# Altium schematic sheet GeneratedSystem.SchDoc
size 244 x 96 mm
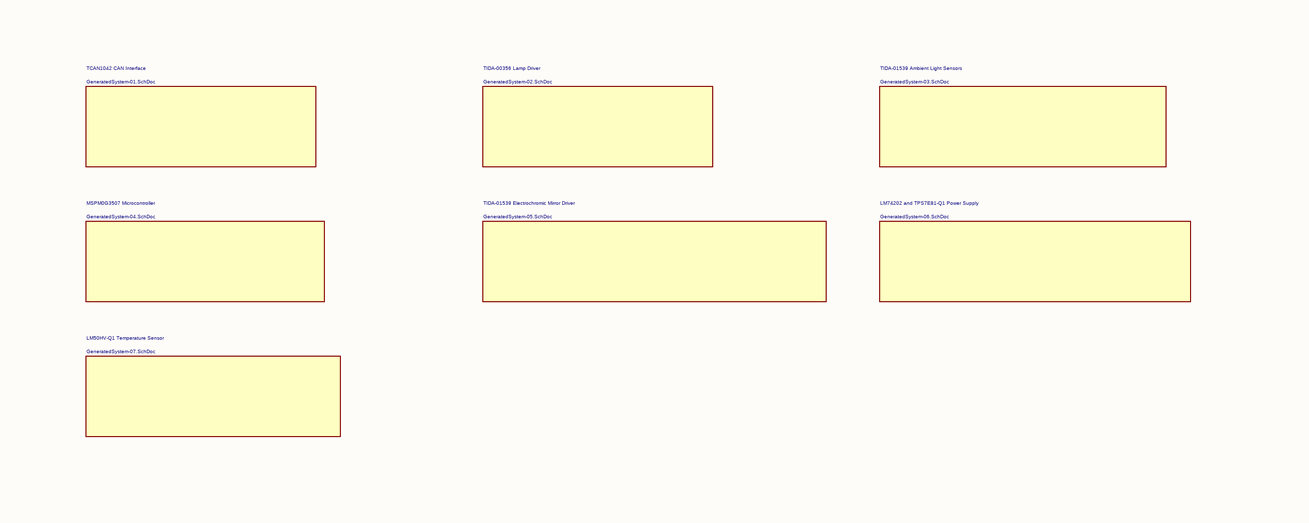
[diagram p0: GeneratedSystem.SchDoc]

## Sub-sheets
LM50HV-Q1 Temperature Sensor = GeneratedSystem-07.SchDoc: no entries
LM74202 and TPS7E81-Q1 Power Supply = GeneratedSystem-06.SchDoc: no entries
MSPM0G3507 Microcontroller = GeneratedSystem-04.SchDoc: no entries
TCAN1042 CAN Interface = GeneratedSystem-01.SchDoc: no entries
TIDA-00356 Lamp Driver = GeneratedSystem-02.SchDoc: no entries
TIDA-01539 Ambient Light Sensors = GeneratedSystem-03.SchDoc: no entries
TIDA-01539 Electrochromic Mirror Driver = GeneratedSystem-05.SchDoc: no entries